# Altium schematic sheet 机械键盘.SchDoc
size A1
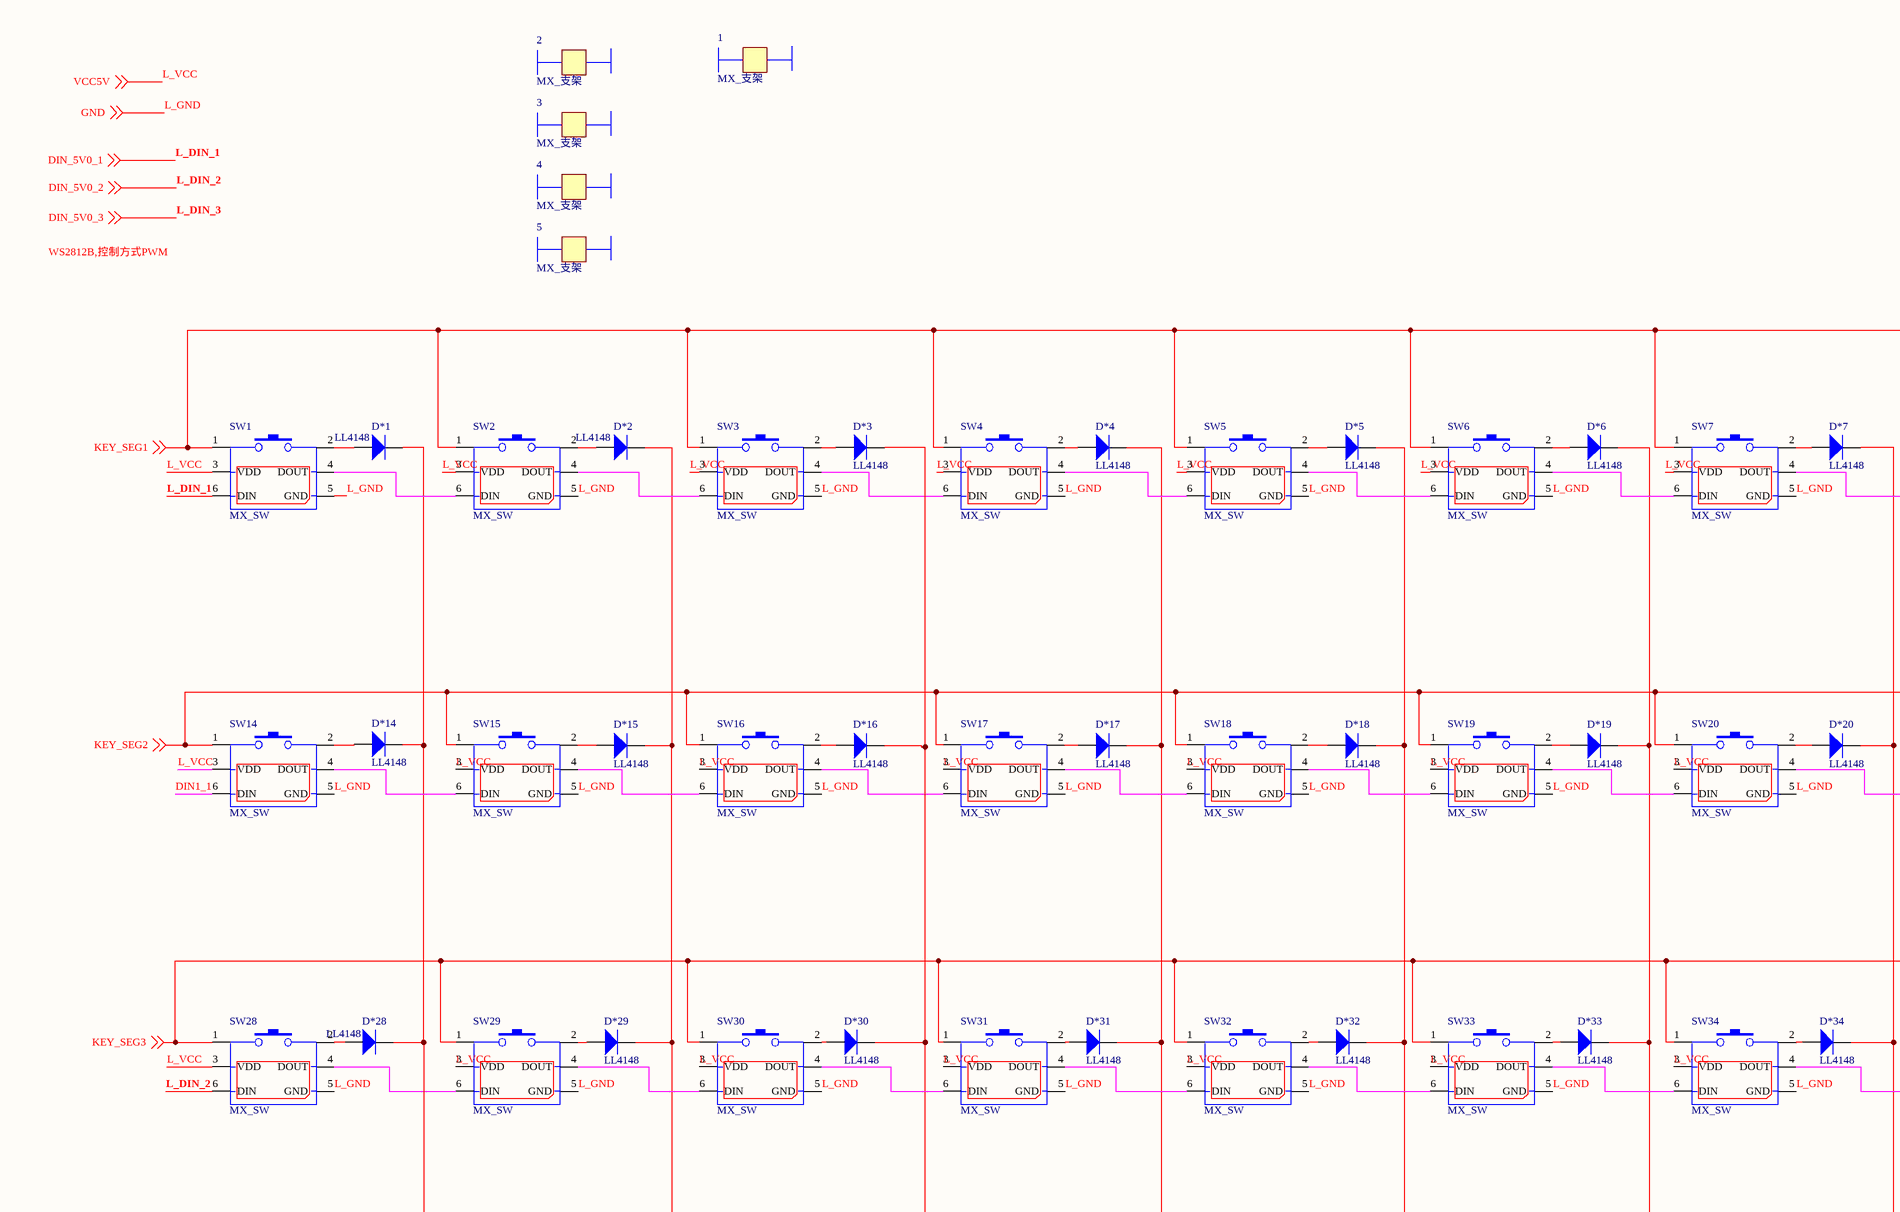
[diagram p0: 机械键盘.SchDoc, top left]
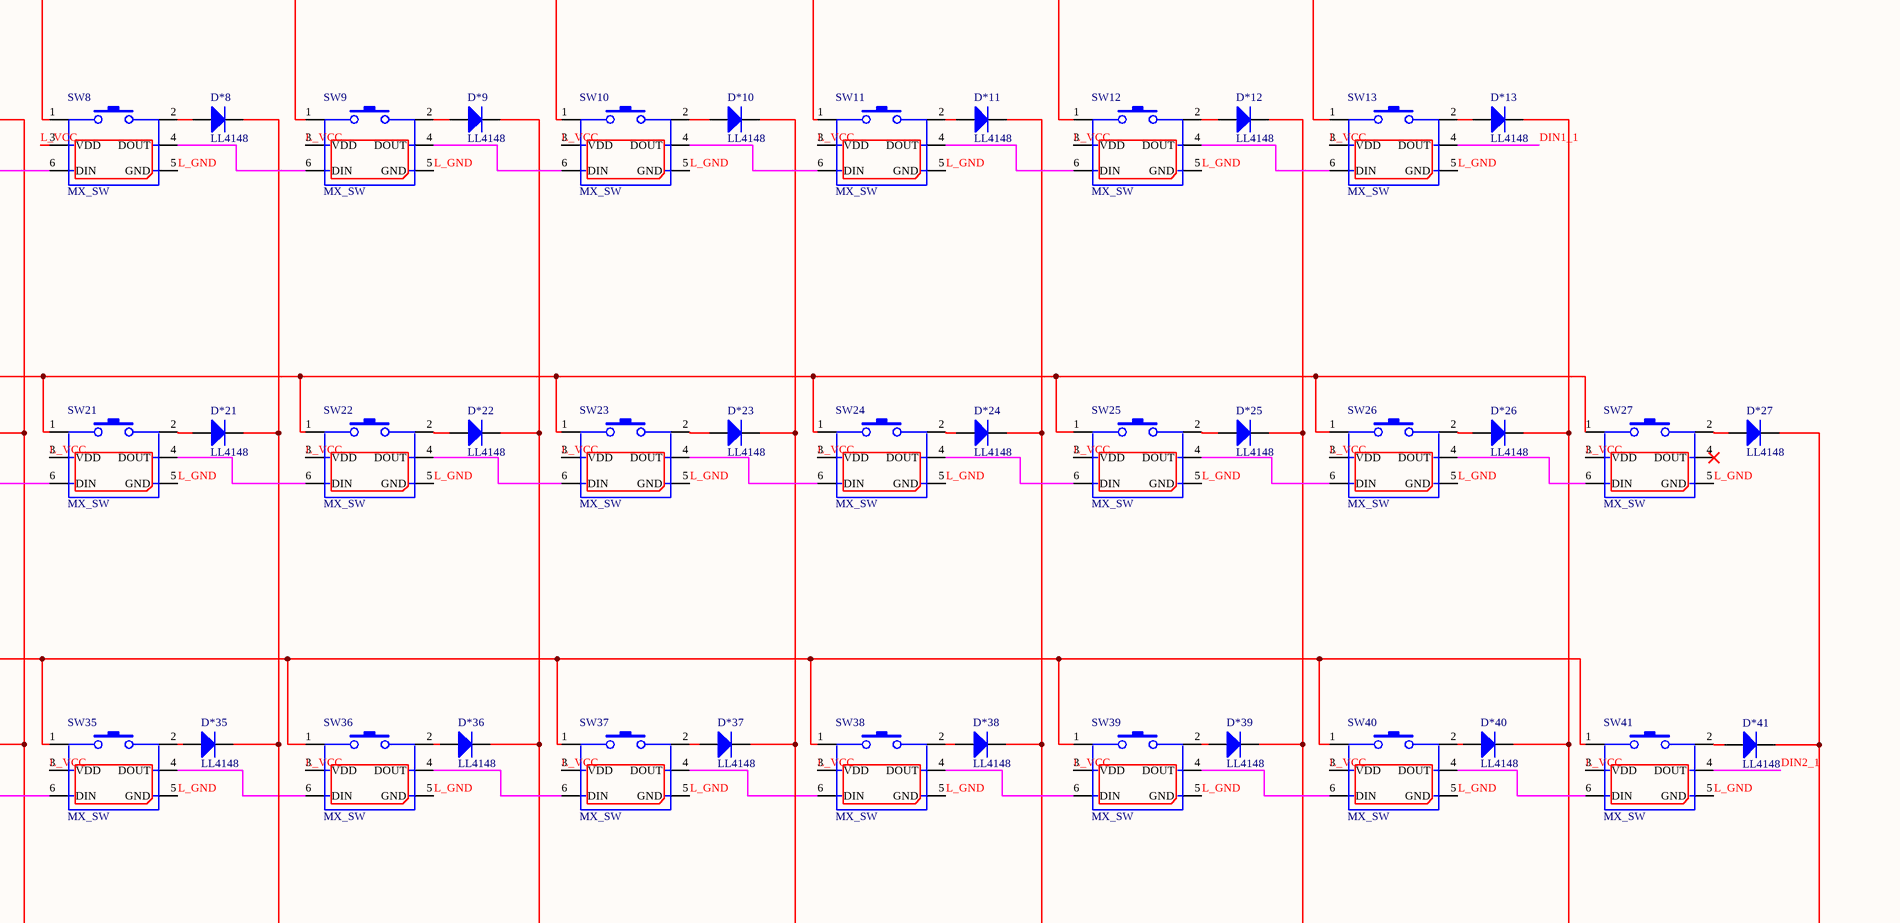
[diagram p1: 机械键盘.SchDoc, top right]
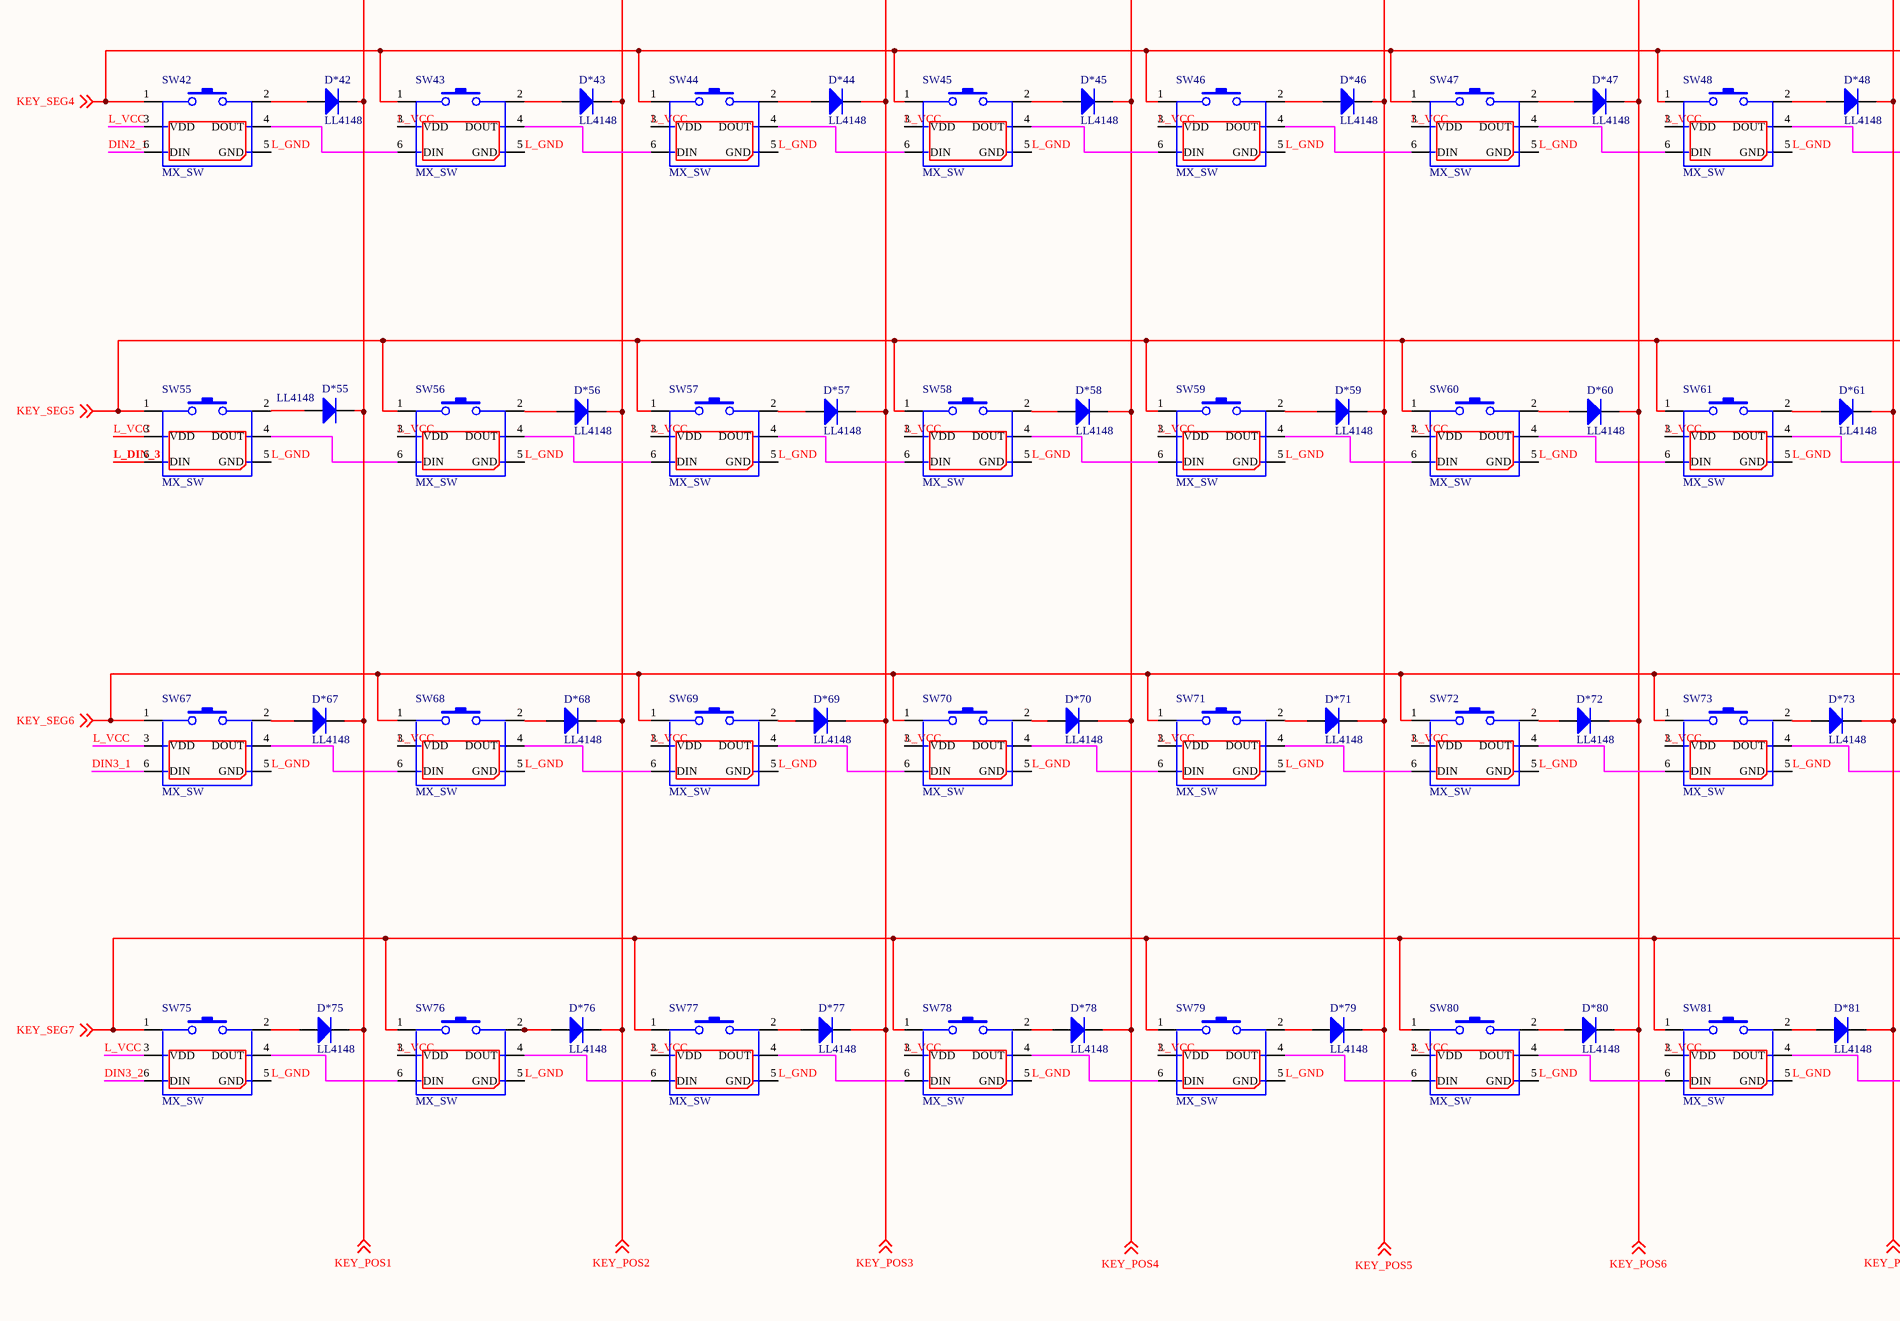
[diagram p2: 机械键盘.SchDoc, bottom left]
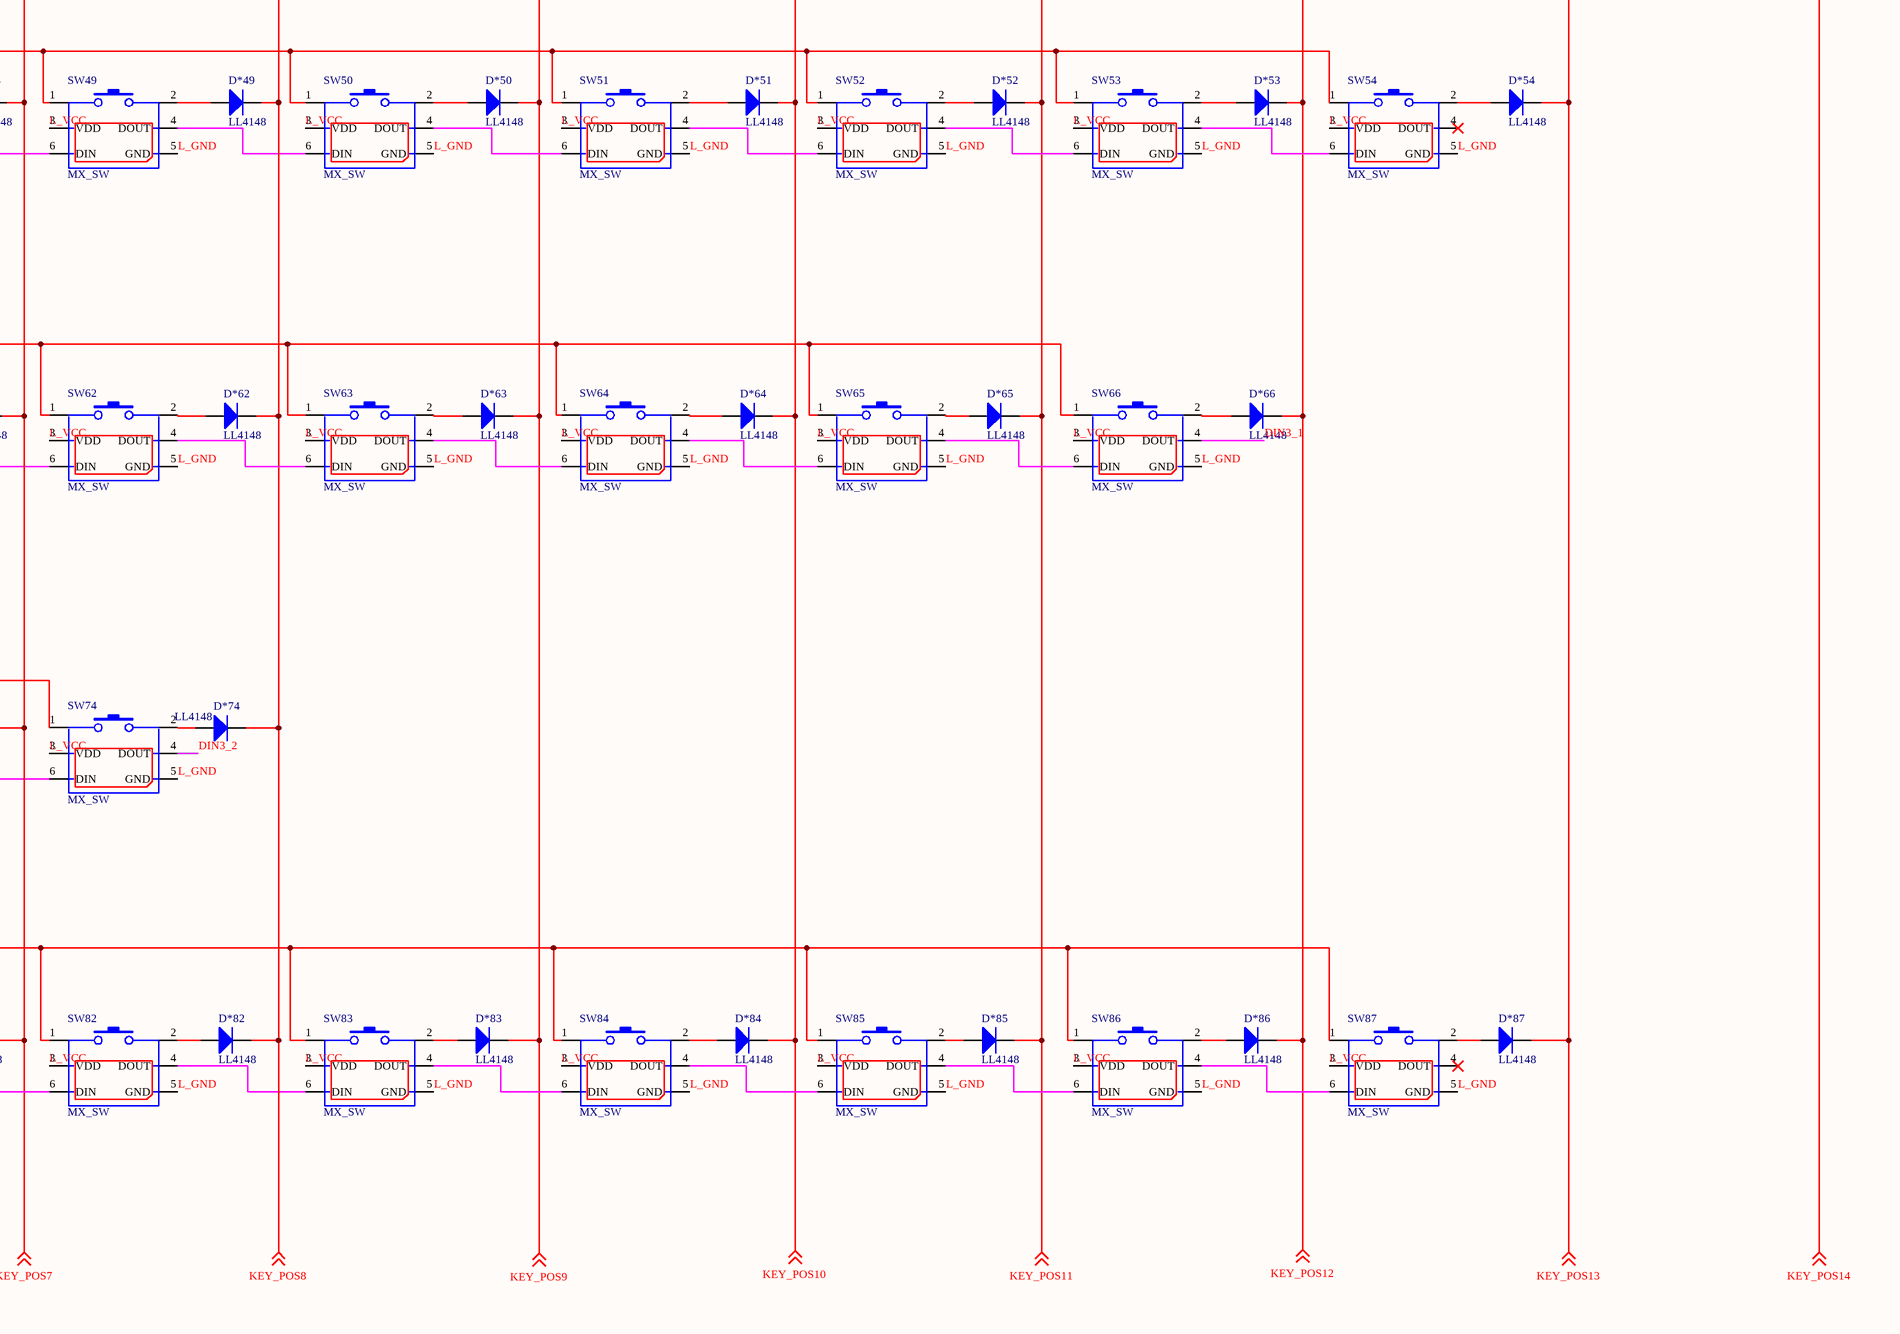
[diagram p3: 机械键盘.SchDoc, bottom right]

## Parts
1  MX_支架  [1x6.25]
2  MX_支架  [1x2]
3  MX_支架  [1x2]
4  MX_支架  [1x2]
5  MX_支架  [1x2]
D*1  LL4148  [LL-34_L3.7-W1.6-RD]
D*2  LL4148  [LL-34_L3.7-W1.6-RD]
D*3  LL4148  [LL-34_L3.7-W1.6-RD]
D*4  LL4148  [LL-34_L3.7-W1.6-RD]
D*5  LL4148  [LL-34_L3.7-W1.6-RD]
D*6  LL4148  [LL-34_L3.7-W1.6-RD]
D*7  LL4148  [LL-34_L3.7-W1.6-RD]
D*8  LL4148  [LL-34_L3.7-W1.6-RD]
D*9  LL4148  [LL-34_L3.7-W1.6-RD]
D*10  LL4148  [LL-34_L3.7-W1.6-RD]
D*11  LL4148  [LL-34_L3.7-W1.6-RD]
D*12  LL4148  [LL-34_L3.7-W1.6-RD]
D*13  LL4148  [LL-34_L3.7-W1.6-RD]
D*14  LL4148  [LL-34_L3.7-W1.6-RD]
D*15  LL4148  [LL-34_L3.7-W1.6-RD]
D*16  LL4148  [LL-34_L3.7-W1.6-RD]
D*17  LL4148  [LL-34_L3.7-W1.6-RD]
D*18  LL4148  [LL-34_L3.7-W1.6-RD]
D*19  LL4148  [LL-34_L3.7-W1.6-RD]
D*20  LL4148  [LL-34_L3.7-W1.6-RD]
D*21  LL4148  [LL-34_L3.7-W1.6-RD]
D*22  LL4148  [LL-34_L3.7-W1.6-RD]
D*23  LL4148  [LL-34_L3.7-W1.6-RD]
D*24  LL4148  [LL-34_L3.7-W1.6-RD]
D*25  LL4148  [LL-34_L3.7-W1.6-RD]
D*26  LL4148  [LL-34_L3.7-W1.6-RD]
D*27  LL4148  [LL-34_L3.7-W1.6-RD]
D*28  LL4148  [LL-34_L3.7-W1.6-RD]
D*29  LL4148  [LL-34_L3.7-W1.6-RD]
D*30  LL4148  [LL-34_L3.7-W1.6-RD]
D*31  LL4148  [LL-34_L3.7-W1.6-RD]
D*32  LL4148  [LL-34_L3.7-W1.6-RD]
D*33  LL4148  [LL-34_L3.7-W1.6-RD]
D*34  LL4148  [LL-34_L3.7-W1.6-RD]
D*35  LL4148  [LL-34_L3.7-W1.6-RD]
D*36  LL4148  [LL-34_L3.7-W1.6-RD]
D*37  LL4148  [LL-34_L3.7-W1.6-RD]
D*38  LL4148  [LL-34_L3.7-W1.6-RD]
D*39  LL4148  [LL-34_L3.7-W1.6-RD]
D*40  LL4148  [LL-34_L3.7-W1.6-RD]
D*41  LL4148  [LL-34_L3.7-W1.6-RD]
D*42  LL4148  [LL-34_L3.7-W1.6-RD]
D*43  LL4148  [LL-34_L3.7-W1.6-RD]
D*44  LL4148  [LL-34_L3.7-W1.6-RD]
D*45  LL4148  [LL-34_L3.7-W1.6-RD]
D*46  LL4148  [LL-34_L3.7-W1.6-RD]
D*47  LL4148  [LL-34_L3.7-W1.6-RD]
D*48  LL4148  [LL-34_L3.7-W1.6-RD]
D*49  LL4148  [LL-34_L3.7-W1.6-RD]
D*50  LL4148  [LL-34_L3.7-W1.6-RD]
D*51  LL4148  [LL-34_L3.7-W1.6-RD]
D*52  LL4148  [LL-34_L3.7-W1.6-RD]
D*53  LL4148  [LL-34_L3.7-W1.6-RD]
D*54  LL4148  [LL-34_L3.7-W1.6-RD]
D*55  LL4148  [LL-34_L3.7-W1.6-RD]
D*56  LL4148  [LL-34_L3.7-W1.6-RD]
D*57  LL4148  [LL-34_L3.7-W1.6-RD]
D*58  LL4148  [LL-34_L3.7-W1.6-RD]
D*59  LL4148  [LL-34_L3.7-W1.6-RD]
D*60  LL4148  [LL-34_L3.7-W1.6-RD]
D*61  LL4148  [LL-34_L3.7-W1.6-RD]
D*62  LL4148  [LL-34_L3.7-W1.6-RD]
D*63  LL4148  [LL-34_L3.7-W1.6-RD]
D*64  LL4148  [LL-34_L3.7-W1.6-RD]
D*65  LL4148  [LL-34_L3.7-W1.6-RD]
D*66  LL4148  [LL-34_L3.7-W1.6-RD]
D*67  LL4148  [LL-34_L3.7-W1.6-RD]
D*68  LL4148  [LL-34_L3.7-W1.6-RD]
D*69  LL4148  [LL-34_L3.7-W1.6-RD]
D*70  LL4148  [LL-34_L3.7-W1.6-RD]
D*71  LL4148  [LL-34_L3.7-W1.6-RD]
D*72  LL4148  [LL-34_L3.7-W1.6-RD]
D*73  LL4148  [LL-34_L3.7-W1.6-RD]
D*74  LL4148  [LL-34_L3.7-W1.6-RD]
D*75  LL4148  [LL-34_L3.7-W1.6-RD]
D*76  LL4148  [LL-34_L3.7-W1.6-RD]
D*77  LL4148  [LL-34_L3.7-W1.6-RD]
D*78  LL4148  [LL-34_L3.7-W1.6-RD]
D*79  LL4148  [LL-34_L3.7-W1.6-RD]
D*80  LL4148  [LL-34_L3.7-W1.6-RD]
D*81  LL4148  [LL-34_L3.7-W1.6-RD]
D*82  LL4148  [LL-34_L3.7-W1.6-RD]
D*83  LL4148  [LL-34_L3.7-W1.6-RD]
D*84  LL4148  [LL-34_L3.7-W1.6-RD]
D*85  LL4148  [LL-34_L3.7-W1.6-RD]
D*86  LL4148  [LL-34_L3.7-W1.6-RD]
D*87  LL4148  [LL-34_L3.7-W1.6-RD]
SW1  MX_SW  [MX_SW-7]
SW2  MX_SW  [MX_SW-7]
SW3  MX_SW  [MX_SW-7]
SW4  MX_SW  [MX_SW-7]
SW5  MX_SW  [MX_SW-7]
SW6  MX_SW  [MX_SW-7]
SW7  MX_SW  [MX_SW-7]
SW8  MX_SW  [MX_SW-7]
SW9  MX_SW  [MX_SW-7]
SW10  MX_SW  [MX_SW-7]
SW11  MX_SW  [MX_SW-7]
SW12  MX_SW  [MX_SW-7]
SW13  MX_SW  [MX_SW-7]
SW14  MX_SW  [MX_SW-7]
SW15  MX_SW  [MX_SW-7]
SW16  MX_SW  [MX_SW-7]
SW17  MX_SW  [MX_SW-7]
SW18  MX_SW  [MX_SW-7]
SW19  MX_SW  [MX_SW-7]
SW20  MX_SW  [MX_SW-7]
SW21  MX_SW  [MX_SW-7]
SW22  MX_SW  [MX_SW-7]
SW23  MX_SW  [MX_SW-7]
SW24  MX_SW  [MX_SW-7]
SW25  MX_SW  [MX_SW-7]
SW26  MX_SW  [MX_SW-7]
SW27  MX_SW  [MX_Backspace]
SW28  MX_SW  [MX_Tab]
SW29  MX_SW  [MX_SW-7]
SW30  MX_SW  [MX_SW-7]
SW31  MX_SW  [MX_SW-7]
SW32  MX_SW  [MX_SW-7]
SW33  MX_SW  [MX_SW-7]
SW34  MX_SW  [MX_SW-7]
SW35  MX_SW  [MX_SW-7]
SW36  MX_SW  [MX_SW-7]
SW37  MX_SW  [MX_SW-7]
SW38  MX_SW  [MX_SW-7]
SW39  MX_SW  [MX_SW-7]
SW40  MX_SW  [MX_SW-7]
SW41  MX_SW  [MX_Tab]
SW42  MX_SW  [MX_CapsLock]
SW43  MX_SW  [MX_SW-7]
SW44  MX_SW  [MX_SW-7]
SW45  MX_SW  [MX_SW-7]
SW46  MX_SW  [MX_SW-7]
SW47  MX_SW  [MX_SW-7]
SW48  MX_SW  [MX_SW-7]
SW49  MX_SW  [MX_SW-7]
SW50  MX_SW  [MX_SW-7]
SW51  MX_SW  [MX_SW-7]
SW52  MX_SW  [MX_SW-7]
SW53  MX_SW  [MX_SW-7]
SW54  MX_SW  [MX_左Shift(Enter)]
SW55  MX_SW  [MX_左Shift(Enter)]
SW56  MX_SW  [MX_SW-7]
SW57  MX_SW  [MX_SW-7]
SW58  MX_SW  [MX_SW-7]
SW59  MX_SW  [MX_SW-7]
SW60  MX_SW  [MX_SW-7]
SW61  MX_SW  [MX_SW-7]
SW62  MX_SW  [MX_SW-7]
SW63  MX_SW  [MX_SW-7]
SW64  MX_SW  [MX_SW-7]
SW65  MX_SW  [MX_SW-7]
SW66  MX_SW  [MX_右Shift]
SW67  MX_SW  [MX_Ctrl(Win)(Alt)]
SW68  MX_SW  [MX_Ctrl(Win)(Alt)]
SW69  MX_SW  [MX_Ctrl(Win)(Alt)]
SW70  MX_SW  [MX_空格]
SW71  MX_SW  [MX_Ctrl(Win)(Alt)]
SW72  MX_SW  [MX_Ctrl(Win)(Alt)]
SW73  MX_SW  [MX_Ctrl(Win)(Alt)]
SW74  MX_SW  [MX_Ctrl(Win)(Alt)]
SW75  MX_SW  [MX_SW-7]
SW76  MX_SW  [MX_SW-7]
SW77  MX_SW  [MX_SW-7]
SW78  MX_SW  [MX_SW-7]
SW79  MX_SW  [MX_SW-7]
SW80  MX_SW  [MX_SW-7]
SW81  MX_SW  [MX_SW-7]
SW82  MX_SW  [MX_SW-7]
SW83  MX_SW  [MX_SW-7]
SW84  MX_SW  [MX_SW-7]
SW85  MX_SW  [MX_SW-7]
SW86  MX_SW  [MX_SW-7]
SW87  MX_SW  [MX_SW-7]

## Nets
DIN1_1: SW13.4(DOUT) SW14.6(DIN)
DIN2_1: SW41.4(DOUT) SW42.6(DIN)
DIN3_1: SW66.4(DOUT) SW67.6(DIN)
DIN3_2: SW74.4(DOUT) SW75.6(DIN)
KEY_POS1: D*1.2 D*14.2 D*28.2 D*42.2 D*55.2 D*67.2 D*75.2 ; off-sheet KEY_POS1
KEY_POS2: D*2.2 D*15.2 D*29.2 D*43.2 D*56.2 D*68.2 D*76.2 ; off-sheet KEY_POS2
KEY_POS3: D*3.2 D*16.2 D*30.2 D*44.2 D*57.2 D*69.2 D*77.2 ; off-sheet KEY_POS3
KEY_POS4: D*4.2 D*17.2 D*31.2 D*45.2 D*58.2 D*70.2 D*78.2 ; off-sheet KEY_POS4
KEY_POS5: D*5.2 D*18.2 D*32.2 D*46.2 D*59.2 D*71.2 D*79.2 ; off-sheet KEY_POS5
KEY_POS6: D*6.2 D*19.2 D*33.2 D*47.2 D*60.2 D*72.2 D*80.2 ; off-sheet KEY_POS6
KEY_POS7: D*7.2 D*20.2 D*34.2 D*48.2 D*61.2 D*73.2 D*81.2 ; off-sheet KEY_POS7
KEY_POS8: D*8.2 D*21.2 D*35.2 D*49.2 D*62.2 D*74.2 D*82.2 ; off-sheet KEY_POS8
KEY_POS9: D*9.2 D*22.2 D*36.2 D*50.2 D*63.2 D*83.2 ; off-sheet KEY_POS9
KEY_POS10: D*10.2 D*23.2 D*37.2 D*51.2 D*64.2 D*84.2 ; off-sheet KEY_POS10
KEY_POS11: D*11.2 D*24.2 D*38.2 D*52.2 D*65.2 D*85.2 ; off-sheet KEY_POS11
KEY_POS12: D*12.2 D*25.2 D*39.2 D*53.2 D*66.2 D*86.2 ; off-sheet KEY_POS12
KEY_POS13: D*13.2 D*26.2 D*40.2 D*54.2 D*87.2 ; off-sheet KEY_POS13
KEY_POS14: D*27.2 D*41.2 ; off-sheet KEY_POS14
KEY_SEG1: SW1.1 SW2.1 SW3.1 SW4.1 SW5.1 SW6.1 SW7.1 SW8.1 SW9.1 SW10.1 SW11.1 SW12.1 SW13.1 ; off-sheet KEY_SEG1
KEY_SEG2: SW14.1 SW15.1 SW16.1 SW17.1 SW18.1 SW19.1 SW20.1 SW21.1 SW22.1 SW23.1 SW24.1 SW25.1 SW26.1 SW27.1 ; off-sheet KEY_SEG2
KEY_SEG3: SW28.1 SW29.1 SW30.1 SW31.1 SW32.1 SW33.1 SW34.1 SW35.1 SW36.1 SW37.1 SW38.1 SW39.1 SW40.1 SW41.1 ; off-sheet KEY_SEG3
KEY_SEG4: SW42.1 SW43.1 SW44.1 SW45.1 SW46.1 SW47.1 SW48.1 SW49.1 SW50.1 SW51.1 SW52.1 SW53.1 SW54.1 ; off-sheet KEY_SEG4
KEY_SEG5: SW55.1 SW56.1 SW57.1 SW58.1 SW59.1 SW60.1 SW61.1 SW62.1 SW63.1 SW64.1 SW65.1 SW66.1 ; off-sheet KEY_SEG5
KEY_SEG6: SW67.1 SW68.1 SW69.1 SW70.1 SW71.1 SW72.1 SW73.1 SW74.1 ; off-sheet KEY_SEG6
KEY_SEG7: SW75.1 SW76.1 SW77.1 SW78.1 SW79.1 SW80.1 SW81.1 SW82.1 SW83.1 SW84.1 SW85.1 SW86.1 SW87.1 ; off-sheet KEY_SEG7
L_DIN_1: SW1.6(DIN) ; off-sheet DIN_5V0_1  [also labelled DIN_5V0_1]
L_DIN_2: SW28.6(DIN) ; off-sheet DIN_5V0_2  [also labelled DIN_5V0_2]
L_DIN_3: SW55.6(DIN) ; off-sheet DIN_5V0_3  [also labelled DIN_5V0_3]
L_GND: SW1.5(GND) SW2.5(GND) SW3.5(GND) SW4.5(GND) SW5.5(GND) SW6.5(GND) SW7.5(GND) SW8.5(GND) SW9.5(GND) SW10.5(GND) SW11.5(GND) SW12.5(GND) SW13.5(GND) SW14.5(GND) SW15.5(GND) SW16.5(GND) SW17.5(GND) SW18.5(GND) SW19.5(GND) SW20.5(GND) SW21.5(GND) SW22.5(GND) SW23.5(GND) SW24.5(GND) SW25.5(GND) SW26.5(GND) SW27.5(GND) SW28.5(GND) SW29.5(GND) SW30.5(GND) SW31.5(GND) SW32.5(GND) SW33.5(GND) SW34.5(GND) SW35.5(GND) SW36.5(GND) SW37.5(GND) SW38.5(GND) SW39.5(GND) SW40.5(GND) SW41.5(GND) SW42.5(GND) SW43.5(GND) SW44.5(GND) SW45.5(GND) SW46.5(GND) SW47.5(GND) SW48.5(GND) SW49.5(GND) SW50.5(GND) SW51.5(GND) SW52.5(GND) SW53.5(GND) SW54.5(GND) SW55.5(GND) SW56.5(GND) SW57.5(GND) SW58.5(GND) SW59.5(GND) SW60.5(GND) SW61.5(GND) SW62.5(GND) SW63.5(GND) SW64.5(GND) SW65.5(GND) SW66.5(GND) SW67.5(GND) SW68.5(GND) SW69.5(GND) SW70.5(GND) SW71.5(GND) SW72.5(GND) SW73.5(GND) SW74.5(GND) SW75.5(GND) SW76.5(GND) SW77.5(GND) SW78.5(GND) SW79.5(GND) SW80.5(GND) SW81.5(GND) SW82.5(GND) SW83.5(GND) SW84.5(GND) SW85.5(GND) SW86.5(GND) SW87.5(GND) ; off-sheet GND  [also labelled GND]
L_VCC: SW1.3(VDD) SW2.3(VDD) SW3.3(VDD) SW4.3(VDD) SW5.3(VDD) SW6.3(VDD) SW7.3(VDD) SW8.3(VDD) SW9.3(VDD) SW10.3(VDD) SW11.3(VDD) SW12.3(VDD) SW13.3(VDD) SW14.3(VDD) SW15.3(VDD) SW16.3(VDD) SW17.3(VDD) SW18.3(VDD) SW19.3(VDD) SW20.3(VDD) SW21.3(VDD) SW22.3(VDD) SW23.3(VDD) SW24.3(VDD) SW25.3(VDD) SW26.3(VDD) SW27.3(VDD) SW28.3(VDD) SW29.3(VDD) SW30.3(VDD) SW31.3(VDD) SW32.3(VDD) SW33.3(VDD) SW34.3(VDD) SW35.3(VDD) SW36.3(VDD) SW37.3(VDD) SW38.3(VDD) SW39.3(VDD) SW40.3(VDD) SW41.3(VDD) SW42.3(VDD) SW43.3(VDD) SW44.3(VDD) SW45.3(VDD) SW46.3(VDD) SW47.3(VDD) SW48.3(VDD) SW49.3(VDD) SW50.3(VDD) SW51.3(VDD) SW52.3(VDD) SW53.3(VDD) SW54.3(VDD) SW55.3(VDD) SW56.3(VDD) SW57.3(VDD) SW58.3(VDD) SW59.3(VDD) SW60.3(VDD) SW61.3(VDD) SW62.3(VDD) SW63.3(VDD) SW64.3(VDD) SW65.3(VDD) SW66.3(VDD) SW67.3(VDD) SW68.3(VDD) SW69.3(VDD) SW70.3(VDD) SW71.3(VDD) SW72.3(VDD) SW73.3(VDD) SW74.3(VDD) SW75.3(VDD) SW76.3(VDD) SW77.3(VDD) SW78.3(VDD) SW79.3(VDD) SW80.3(VDD) SW81.3(VDD) SW82.3(VDD) SW83.3(VDD) SW84.3(VDD) SW85.3(VDD) SW86.3(VDD) SW87.3(VDD) ; off-sheet VCC5V  [also labelled VCC5V]
NetD*1_1: D*1.1 SW1.2
NetD*2_1: D*2.1 SW2.2
NetD*3_1: D*3.1 SW3.2
NetD*4_1: D*4.1 SW4.2
NetD*5_1: D*5.1 SW5.2
NetD*6_1: D*6.1 SW6.2
NetD*7_1: D*7.1 SW7.2
NetD*8_1: D*8.1 SW8.2
NetD*9_1: D*9.1 SW9.2
NetD*10_1: D*10.1 SW10.2
NetD*11_1: D*11.1 SW11.2
NetD*12_1: D*12.1 SW12.2
NetD*13_1: D*13.1 SW13.2
NetD*14_1: D*14.1 SW14.2
NetD*15_1: D*15.1 SW15.2
NetD*16_1: D*16.1 SW16.2
NetD*17_1: D*17.1 SW17.2
NetD*18_1: D*18.1 SW18.2
NetD*19_1: D*19.1 SW19.2
NetD*20_1: D*20.1 SW20.2
NetD*21_1: D*21.1 SW21.2
NetD*22_1: D*22.1 SW22.2
NetD*23_1: D*23.1 SW23.2
NetD*24_1: D*24.1 SW24.2
NetD*25_1: D*25.1 SW25.2
NetD*26_1: D*26.1 SW26.2
NetD*27_1: D*27.1 SW27.2
NetD*28_1: D*28.1 SW28.2
NetD*29_1: D*29.1 SW29.2
NetD*30_1: D*30.1 SW30.2
NetD*31_1: D*31.1 SW31.2
NetD*32_1: D*32.1 SW32.2
NetD*33_1: D*33.1 SW33.2
NetD*34_1: D*34.1 SW34.2
NetD*35_1: D*35.1 SW35.2
NetD*36_1: D*36.1 SW36.2
NetD*37_1: D*37.1 SW37.2
NetD*38_1: D*38.1 SW38.2
NetD*39_1: D*39.1 SW39.2
NetD*40_1: D*40.1 SW40.2
NetD*41_1: D*41.1 SW41.2
NetD*42_1: D*42.1 SW42.2
NetD*43_1: D*43.1 SW43.2
NetD*44_1: D*44.1 SW44.2
NetD*45_1: D*45.1 SW45.2
NetD*46_1: D*46.1 SW46.2
NetD*47_1: D*47.1 SW47.2
NetD*48_1: D*48.1 SW48.2
NetD*49_1: D*49.1 SW49.2
NetD*50_1: D*50.1 SW50.2
NetD*51_1: D*51.1 SW51.2
NetD*52_1: D*52.1 SW52.2
NetD*53_1: D*53.1 SW53.2
NetD*54_1: D*54.1 SW54.2
NetD*55_1: D*55.1 SW55.2
NetD*56_1: D*56.1 SW56.2
NetD*57_1: D*57.1 SW57.2
NetD*58_1: D*58.1 SW58.2
NetD*59_1: D*59.1 SW59.2
NetD*60_1: D*60.1 SW60.2
NetD*61_1: D*61.1 SW61.2
NetD*62_1: D*62.1 SW62.2
NetD*63_1: D*63.1 SW63.2
NetD*64_1: D*64.1 SW64.2
NetD*65_1: D*65.1 SW65.2
NetD*66_1: D*66.1 SW66.2
NetD*67_1: D*67.1 SW67.2
NetD*68_1: D*68.1 SW68.2
NetD*69_1: D*69.1 SW69.2
NetD*70_1: D*70.1 SW70.2
NetD*71_1: D*71.1 SW71.2
NetD*72_1: D*72.1 SW72.2
NetD*73_1: D*73.1 SW73.2
NetD*74_1: D*74.1 SW74.2
NetD*75_1: D*75.1 SW75.2
NetD*76_1: D*76.1 SW76.2
NetD*77_1: D*77.1 SW77.2
NetD*78_1: D*78.1 SW78.2
NetD*79_1: D*79.1 SW79.2
NetD*80_1: D*80.1 SW80.2
NetD*81_1: D*81.1 SW81.2
NetD*82_1: D*82.1 SW82.2
NetD*83_1: D*83.1 SW83.2
NetD*84_1: D*84.1 SW84.2
NetD*85_1: D*85.1 SW85.2
NetD*86_1: D*86.1 SW86.2
NetD*87_1: D*87.1 SW87.2
NetSW1_4: SW1.4(DOUT) SW2.6(DIN)
NetSW2_4: SW2.4(DOUT) SW3.6(DIN)
NetSW3_4: SW3.4(DOUT) SW4.6(DIN)
NetSW4_4: SW4.4(DOUT) SW5.6(DIN)
NetSW5_4: SW5.4(DOUT) SW6.6(DIN)
NetSW6_4: SW6.4(DOUT) SW7.6(DIN)
NetSW7_4: SW7.4(DOUT) SW8.6(DIN)
NetSW8_4: SW8.4(DOUT) SW9.6(DIN)
NetSW9_4: SW9.4(DOUT) SW10.6(DIN)
NetSW10_4: SW10.4(DOUT) SW11.6(DIN)
NetSW11_4: SW11.4(DOUT) SW12.6(DIN)
NetSW12_4: SW12.4(DOUT) SW13.6(DIN)
NetSW14_4: SW14.4(DOUT) SW15.6(DIN)
NetSW15_4: SW15.4(DOUT) SW16.6(DIN)
NetSW16_4: SW16.4(DOUT) SW17.6(DIN)
NetSW17_4: SW17.4(DOUT) SW18.6(DIN)
NetSW18_4: SW18.4(DOUT) SW19.6(DIN)
NetSW19_4: SW19.4(DOUT) SW20.6(DIN)
NetSW20_4: SW20.4(DOUT) SW21.6(DIN)
NetSW21_4: SW21.4(DOUT) SW22.6(DIN)
NetSW22_4: SW22.4(DOUT) SW23.6(DIN)
NetSW23_4: SW23.4(DOUT) SW24.6(DIN)
NetSW24_4: SW24.4(DOUT) SW25.6(DIN)
NetSW25_4: SW25.4(DOUT) SW26.6(DIN)
NetSW26_4: SW26.4(DOUT) SW27.6(DIN)
NetSW28_4: SW28.4(DOUT) SW29.6(DIN)
NetSW29_4: SW29.4(DOUT) SW30.6(DIN)
NetSW30_4: SW30.4(DOUT) SW31.6(DIN)
NetSW31_4: SW31.4(DOUT) SW32.6(DIN)
NetSW32_4: SW32.4(DOUT) SW33.6(DIN)
NetSW33_4: SW33.4(DOUT) SW34.6(DIN)
NetSW34_4: SW34.4(DOUT) SW35.6(DIN)
NetSW35_4: SW35.4(DOUT) SW36.6(DIN)
NetSW36_4: SW36.4(DOUT) SW37.6(DIN)
NetSW37_4: SW37.4(DOUT) SW38.6(DIN)
NetSW38_4: SW38.4(DOUT) SW39.6(DIN)
NetSW39_4: SW39.4(DOUT) SW40.6(DIN)
NetSW40_4: SW40.4(DOUT) SW41.6(DIN)
NetSW42_4: SW42.4(DOUT) SW43.6(DIN)
NetSW43_4: SW43.4(DOUT) SW44.6(DIN)
NetSW44_4: SW44.4(DOUT) SW45.6(DIN)
NetSW45_4: SW45.4(DOUT) SW46.6(DIN)
NetSW46_4: SW46.4(DOUT) SW47.6(DIN)
NetSW47_4: SW47.4(DOUT) SW48.6(DIN)
NetSW48_4: SW48.4(DOUT) SW49.6(DIN)
NetSW49_4: SW49.4(DOUT) SW50.6(DIN)
NetSW50_4: SW50.4(DOUT) SW51.6(DIN)
NetSW51_4: SW51.4(DOUT) SW52.6(DIN)
NetSW52_4: SW52.4(DOUT) SW53.6(DIN)
NetSW53_4: SW53.4(DOUT) SW54.6(DIN)
NetSW55_4: SW55.4(DOUT) SW56.6(DIN)
NetSW56_4: SW56.4(DOUT) SW57.6(DIN)
NetSW57_4: SW57.4(DOUT) SW58.6(DIN)
NetSW58_4: SW58.4(DOUT) SW59.6(DIN)
NetSW59_4: SW59.4(DOUT) SW60.6(DIN)
NetSW60_4: SW60.4(DOUT) SW61.6(DIN)
NetSW61_4: SW61.4(DOUT) SW62.6(DIN)
NetSW62_4: SW62.4(DOUT) SW63.6(DIN)
NetSW63_4: SW63.4(DOUT) SW64.6(DIN)
NetSW64_4: SW64.4(DOUT) SW65.6(DIN)
NetSW65_4: SW65.4(DOUT) SW66.6(DIN)
NetSW67_4: SW67.4(DOUT) SW68.6(DIN)
NetSW68_4: SW68.4(DOUT) SW69.6(DIN)
NetSW69_4: SW69.4(DOUT) SW70.6(DIN)
NetSW70_4: SW70.4(DOUT) SW71.6(DIN)
NetSW71_4: SW71.4(DOUT) SW72.6(DIN)
NetSW72_4: SW72.4(DOUT) SW73.6(DIN)
NetSW73_4: SW73.4(DOUT) SW74.6(DIN)
NetSW75_4: SW75.4(DOUT) SW76.6(DIN)
NetSW76_4: SW76.4(DOUT) SW77.6(DIN)
NetSW77_4: SW77.4(DOUT) SW78.6(DIN)
NetSW78_4: SW78.4(DOUT) SW79.6(DIN)
NetSW79_4: SW79.4(DOUT) SW80.6(DIN)
NetSW80_4: SW80.4(DOUT) SW81.6(DIN)
NetSW81_4: SW81.4(DOUT) SW82.6(DIN)
NetSW82_4: SW82.4(DOUT) SW83.6(DIN)
NetSW83_4: SW83.4(DOUT) SW84.6(DIN)
NetSW84_4: SW84.4(DOUT) SW85.6(DIN)
NetSW85_4: SW85.4(DOUT) SW86.6(DIN)
NetSW86_4: SW86.4(DOUT) SW87.6(DIN)

Not connected (* = marked no-connect by the designer): SW27 4(DOUT)*; SW54 4(DOUT)*; SW87 4(DOUT)*

## Notes on the sheet
- WS2812B,控制方式PWM
- Title
- Size:
- Date:
- File:
- A1
- Number:
- Time:
- Revision:
- Sheet
- of

## Library data of the parts
SW1-SW87 = MX_SW-7: with Fixation pins  1-Pole w/Diode